# Altium project UCC 28180 PFC-V02.PrjPcb (part 1 of 2)
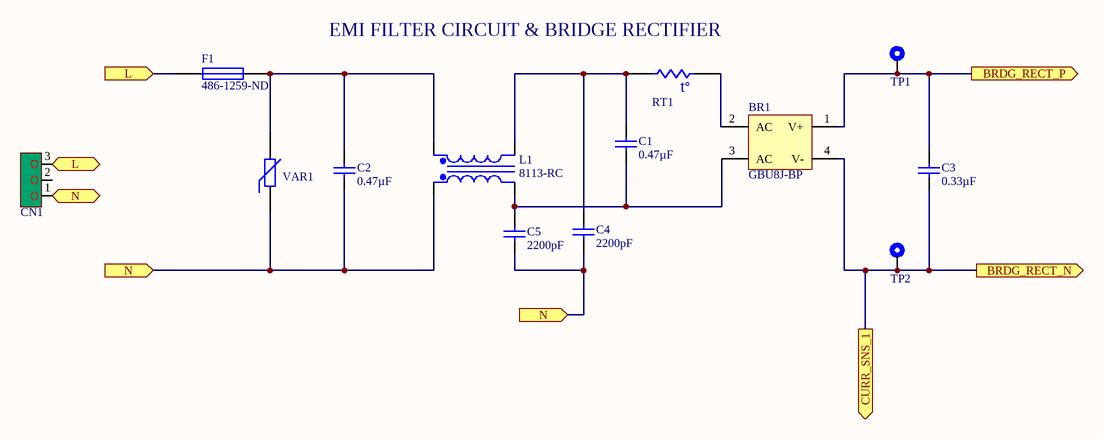
[diagram p0: UCC 28180-1-V02.SchDoc]
3 sheets, 78 parts. Net scope: flat (ports and power ports of the same name join across sheets).
Board file: UCC28180-V02.PcbDoc
Sheets:
  UCC 28180-1-V02.SchDoc
  UCC28180-2-V02.SchDoc
  UCC28180-3-V02.SchDoc

## Sheet UCC 28180-1-V02.SchDoc: Title is Here
size B; Author: Taisen Zhuang; Organization: Altium Limited; Address1: L3, 12a Rodborough Rd; Address2: Frenchs Forest; Address3: NSW; Address4: Australia 2086; DocumentNumber: FMC_Microzed; Revision: B; SheetNumber: 1; SheetTotal: 3

### Parts
BR1  GBU8J-BP  [GBU8J]
C1  Capacitance: 0.47µF  [ECQ-U2A474ML]  (hidden comment: ECQ-U2A474ML)
C2  Capacitance: 0.47µF  [ECQ-U2A474ML]  (hidden comment: ECQ-U2A474ML)
C3  Capacitance: 0.33µF  [CAPFILM0.33U]  (hidden comment: ECQ-U2A334ML)
C4  Capacitance: 2200pF  [CS11-E2GA222MYNS]  (hidden comment: CS11-E2GA222MYNS)
C5  Capacitance: 2200pF  [CS11-E2GA222MYNS]  (hidden comment: CS11-E2GA222MYNS)
CN1  1935789  [CONN_1935789]  (value not drawn)
F1  Supplier Part Number 1: 486-1259-ND  [0031.8211]  (hidden comment: FUSE)
L1  8113-RC  [EMI Choke]
RT1  CL-40  [CL-40]  (value not drawn)
TP1  5006  [Test Point]  (value not drawn)
TP2  5006  [Test Point]  (value not drawn)
VAR1  S10K275E2  [S10K275E2]  (value not drawn)

### Ports
BRDG_RECT_N (out), BRDG_RECT_P (out), CURR_SNS_1 (out), L (in), L (out), N (in), N (out)

### Nets
NetBR1_1: BR1.1(V+) C3.2 TP1.1 ; port BRDG_RECT_P
NetBR1_2: BR1.2(AC) RT1.1
NetBR1_3: BR1.3(AC) C1.1 C5.2 L1.2(Pri-)
NetBR1_4: BR1.4(V-) C3.1 TP2.1 ; port BRDG_RECT_N, port CURR_SNS_1
NetC1_2: C1.2 C4.2 L1.3(Sec-) RT1.2
NetC2_1: C2.1 F1.2 L1.4(Sec+) VAR1.2
NetC2_2: C2.2 C4.1 C5.1 CN1.1 L1.1(Pri+) VAR1.1 ; port N
NetCN1_3: CN1.3 F1.1 ; port L

Not connected (* = marked no-connect by the designer): CN1 2

### Notes on the sheet
- (near RT1) EMI FILTER CIRCUIT & BRIDGE RECTIFIER
- PMLS Engineers R&D
- Title:
- Size:
- Date:
- B
- Document Number:
- Sheet:
- of
- Author:
- Rev:
- (in symbol CL-40) t°

### Library data of the parts
BR1 = GBU8J-BP: RECT BRIDGE GPP 8A 600V GBU; Manufacturer 1: Micro Commercial Co; Category 1: Discrete Semiconductor Products; Diode Type: Single Phase; Supplier 1: Digi-Key; Supplier Part Number 1: GBU8J-BPMS-ND; RoHS 1: RoHS Compliant; Description 1: RECT BRIDGE GPP 8A 600V GBU; Stock 1: 5723; Pricing 1: 1=0.98, 10=0.868, 25=0.784, 100=0.686, 250=0.602, 500=0.532, 1000=0.42, 2500=0.392, 5000=0.3724 (USD); Packaging: Tube; Part Status: Active; Voltage - Peak Reverse (Max): 600V; Current - DC Forward (If) (Max): 8A; Mounting Type: Through Hole; Package / Case: 4-SIP, GBU; Operating Temperature: -55°C ~ 150°C (TJ); Supplier Device Package: GBU; ComponentLink1URL: http://www.mccsemi.com/up_pdf/GBU8A-GBU8M(GBU).pdf; ComponentLink1Description: http://www.mccsemi.com/up_pdf/GBU8A-GBU8M(GBU).pdf; Manufacturer Part Number 1: GBU8J-BP
C1 C2 = ECQ-U2A474ML: CAP FILM 0.47UF 20% 275VAC RAD; Manufacturer 1: Panasonic Electronic Components; Category 1: Capacitors; Voltage Rating - AC: 275V; Dielectric Material: Polyester, Metallized; Supplier 1: Digi-Key; Supplier Part Number 1: P10734-ND; Manufacturer Part Number 1: ECQ-U2A474ML; RoHS 1: RoHS Compliant; Description 1: CAP FILM 0.47UF 20% 275VAC RAD; Stock 1: 12592; Pricing 1: 1=0.63, 10=0.464, 25=0.3976, 50=0.371, 100=0.318, 250=0.29152, 500=0.25176, 1000=0.212, 5000=0.1855 (USD); Packaging: Bulk; Part Status: Active; Tolerance: ±20%; Voltage Rating - DC: -; ESR (Equivalent Series Resistance): -; Operating Temperature: -40°C ~ 100°C; Mounting Type: Through Hole; Package / Case: Radial; Size / Dimension: 1.004" L x 0.335" W (25.50mm x 8.50mm); Height - Seated (Max): 0.709" (18.00mm); Termination: PC Pins; Lead Spacing: 0.886" (22.50mm); Applications: EMI, RFI Suppression; Features: X2 Safety Rated; ComponentLink1URL: http://industrial.panasonic.com/www-cgi/jvcr13pz.cgi?E+PZ+3+ABD0029+ECQU2A474ML+7+WW; ComponentLink1Description: http://industrial.panasonic.com/www-cgi/jvcr13pz.cgi?E+PZ+3+ABD0029+ECQU2A474ML+7+WW
C3 = ECQ-U2A334ML: CAP FILM 0.33UF 20% 275VAC RAD; Manufacturer 1: Panasonic Electronic Components; Category 1: Capacitors; Voltage Rating - AC: 275V; Dielectric Material: Polyester, Metallized; Supplier 1: Digi-Key; Supplier Part Number 1: P10733-ND; Manufacturer Part Number 1: ECQ-U2A334ML; RoHS 1: RoHS Compliant; Description 1: CAP FILM 0.33UF 20% 275VAC RAD; Stock 1: 584; Pricing 1: 1=0.6, 10=0.428, 25=0.3652, 50=0.3234, 100=0.2816, 250=0.23988, 500=0.2086, 1000=0.17731, 5000=0.15645 (USD); Packaging: Bulk; Part Status: Active; Tolerance: ±20%; Voltage Rating - DC: -; ESR (Equivalent Series Resistance): -; Operating Temperature: -40°C ~ 100°C; Mounting Type: Through Hole; Package / Case: Radial; Size / Dimension: 0.689" L x 0.374" W (17.50mm x 9.50mm); Height - Seated (Max): 0.709" (18.00mm); Termination: PC Pins; Lead Spacing: 0.591" (15.00mm); Applications: EMI, RFI Suppression; Features: X2 Safety Rated; ComponentLink1URL: http://industrial.panasonic.com/www-cgi/jvcr13pz.cgi?E+PZ+3+ABD0029+ECQU2A334ML+7+WW; ComponentLink1Description: http://industrial.panasonic.com/www-cgi/jvcr13pz.cgi?E+PZ+3+ABD0029+ECQU2A334ML+7+WW
C4 C5 = CS11-E2GA222MYNS: CAP CER 2200PF 250VAC RADIAL; Manufacturer 1: TDK Corporation; Category 1: Capacitors; Tolerance: ±20%; Temperature Coefficient: E; Ratings: X1, Y2; Supplier 1: Digi-Key; Supplier Part Number 1: 445-2424-ND; Manufacturer Part Number 1: CS11-E2GA222MYNS; RoHS 1: RoHS Compliant; Description 1: CAP CER 2200PF 250VAC RADIAL; Stock 1: 67; Pricing 1: 1=0.5, 10=0.349, 100=0.2093, 250=0.17436, 500=0.15694, 1000=0.13253, 5000=0.11858, 10000=0.1116, 25000=0.10463 (USD); Packaging: Bulk; Part Status: Obsolete; Voltage - Rated: 250VAC; Operating Temperature: -25°C ~ 105°C; Features: High Voltage; Applications: Safety; Failure Rate: -; Mounting Type: Through Hole; Package / Case: Radial, Disc; Size / Dimension: 0.413" Dia (10.50mm); Height - Seated (Max): 0.571" (14.50mm); Thickness (Max): -; Lead Spacing: 0.295" (7.50mm); Lead Style: Straight; ComponentLink1URL: http://media.digikey.com/pdf/Data%20Sheets/TDK%20PDFs/CS_Series.pdf; ComponentLink1Description: http://media.digikey.com/pdf/Data%20Sheets/TDK%20PDFs/CS_Series.pdf
CN1 = 1935789: CONN TERM BLOCK 3POS 5.0MM; Manufacturer 1: Phoenix Contact; Category 1: Connectors, Interconnects; Number of Levels: 1; Positions Per Level: 3; Pitch: 0.197" (5.00mm); Mating Orientation: Horizontal with Board; Current: 20A; Voltage: 300V; Wire Gauge: 12-20 AWG; Wire Termination: Screw; Torque - Screw: 0.45-0.5 Nm (3.9-4.4 Lb-In); Screw Thread: M3; Supplier 1: Digi-Key; Supplier Part Number 1: 277-6072-ND; Manufacturer Part Number 1: 1935789; RoHS 1: RoHS Compliant; Description 1: CONN TERM BLOCK 3POS 5.0MM; Stock 1: 4677; Pricing 1: 1=0.66, 10=0.633, 50=0.605, 100=0.5885, 250=0.55, 500=0.506, 1000=0.4675 (USD); Packaging: Bulk; Part Status: Active; Mounting Type: Through Hole; Features: Interlocking (Side); Color: Green; Operating Temperature: -; Housing Material: Polyamide (PA), Nylon; Contact Material - Plating: -; Clamp Material - Plating: -; Screw Material - Plating: -; ComponentLink1URL: http://media.digikey.com/pdf/Data%20Sheets/Phoenix%20Contact%20PDFs/COMBICON%20Compact%20PT2,5.pdf; ComponentLink1Description: http://media.digikey.com/pdf/Data%20Sheets/Phoenix%20Contact%20PDFs/COMBICON%20Compact%20PT2,5.pdf
F1 = FUSE: Manufacturer: Schurter Inc.; Fuseholder Type: Block; Fuse Type: Cartridge; For Use With/Related Products: 5mm x 20mm; Number of Circuits: 1; Voltage: 500V; Current Rating: 10A; Supplier 1: Digi-Key; Manufacturer Part Number: 0031.8211; RoHS: RoHS Compliant; Category: Circuit Protection; Stock 1: 17476; Pricing 1: 1=0.69, 50=0.4932, 100=0.4658, 250=0.4384, 500=0.411, 1000=0.3836, 5000=0.36442 (USD); Part Status: Active; Fuse Size: 5mm x 20mm; Mounting Type: PCB; Orientation: Horizontal; Termination Style: PC Pin; Contact Material: Copper Alloy; Contact Finish: Tin; ComponentLink1URL: http://www.schurterinc.com/bundles/snceschurter/epim/_ProdPool_/newDS/en/typ_OGN.pdf; ComponentLink1Description: http://www.schurterinc.com/bundles/snceschurter/epim/_ProdPool_/newDS/en/typ_OGN.pdf
L1 = 8113-RC: CMC 5MH 8.9A 2LN TH; Manufacturer 1: Bourns Inc.; Category 1: Filters; Number of Lines: 2; Inductance @ Frequency: 5mH @ 1kHz; DC Resistance (DCR) (Max): 22 mOhm; Supplier 1: Digi-Key; Supplier Part Number 1: M8908-ND; RoHS 1: RoHS Compliant; Description 1: CMC 5MH 8.9A 2LN TH; Stock 1: 1449; Pricing 1: 1=7.52, 10=6.688, 25=6.1864, 50=5.5594 (USD); Packaging: Tray; Part Status: Active; Filter Type: -; Impedance @ Frequency: -; Current Rating (Max): 8.9A; Voltage Rating - DC: -; Voltage Rating - AC: -; Operating Temperature: -55°C ~ 105°C; Ratings: -; Approvals: -; Features: -; Mounting Type: Through Hole; Size / Dimension: 1.450" L x 0.800" W (36.83mm x 20.32mm); Height (Max): 1.500" (38.10mm); Package / Case: Vertical, 4 PC Pin; ComponentLink1URL: http://www.bourns.com/docs/Product-Datasheets/8100_series.pdf; ComponentLink1Description: http://www.bourns.com/docs/Product-Datasheets/8100_series.pdf; Manufacturer Part Number 1: 8113-RC
RT1 = CL-40: ICL 5 OHM 25% 6A 19.56MM; Manufacturer 1: Amphenol Advanced Sensors; Category 1: Circuit Protection; R @ 25°C: 5 Ohm; R @ Current: 0.11 Ohm; Approvals: UL; Supplier 1: Digi-Key; Supplier Part Number 1: KC004L-ND; Manufacturer Part Number 1: CL-40; RoHS 1: RoHS Compliant; Description 1: ICL 5 OHM 25% 6A 19.56MM; Stock 1: 7009; Pricing 1: 1=1.56, 5=1.512, 10=1.415, 25=1.3664, 50=1.1712, 100=0.976, 250=0.9516, 500=0.8052, 1000=0.7076 (USD); Packaging: Bulk; Part Status: Active; Tolerance: ±25%; Current - Steady State Max: 6A; Diameter: 0.77" (19.56mm); Lead Spacing: 0.328" (8.33mm); ComponentLink1URL: http://www.amphenol-sensors.com/index.php?option=com_edocman&task=document.download&id=90; ComponentLink1Description: http://www.amphenol-sensors.com/index.php?option=com_edocman&task=document.download&id=90
TP1 TP2 = 5006: TEST POINT PC COMPACT .063"D BLK; Manufacturer 1: Keystone Electronics; Category 1: Test and Measurement; Plating: Silver; Material - Insulation: Nylon 46, UL 94V-0; Material - Body: Phosphor Bronze; Supplier 1: Digi-Key; Supplier Part Number 1: 36-5006-ND; Manufacturer Part Number 1: 5006; RoHS 1: RoHS Compliant; Description 1: TEST POINT PC COMPACT .063"D BLK; Stock 1: 199444; Pricing 1: 1=0.37, 10=0.316, 50=0.2298, 100=0.2209, 250=0.19832, 500=0.18932, 1000=0.1616, 2500=0.14424, 5000=0.13523 (USD); Packaging: Bulk; Part Status: Active; Type: PC Test Point, Compact; Mounting Type: 0.063" (1.60mm) Hole Diameter; Color: Black; Size / Dimension: 0.125" Dia x 0.220" L (3.18mm x 5.59mm); ComponentLink1URL: http://www.keyelco.com/product-pdf.cfm?p=1314; ComponentLink1Description: http://www.keyelco.com/product-pdf.cfm?p=1314
VAR1 = S10K275E2: VARISTOR 430V 3.5KA DISC 10MM; Manufacturer 1: EPCOS (TDK); Category 1: Circuit Protection; Varistor Voltage (Min): 387V; Varistor Voltage (Max): 473V; Energy: 55J; Number of Circuits: 1; Maximum AC Volts: 275VAC; Maximum DC Volts: 350VDC; Supplier 1: Digi-Key; Supplier Part Number 1: 495-1433-ND; RoHS 1: RoHS Compliant; Description 1: VARISTOR 430V 3.5KA DISC 10MM; Stock 1: 24715; Pricing 1: 1=0.48, 10=0.4, 100=0.3003, 500=0.22022, 1000=0.17017, 5000=0.14515, 10000=0.13514 (USD); Packaging: Bulk; Part Status: Active; Varistor Voltage (Typ): 430V; Current - Surge: 3.5kA; Mounting Type: Through Hole; Package / Case: Disc 10mm; ComponentLink1URL: http://en.tdk.eu/inf/70/db/var_11/SIOV_Leaded_AdvanceD.pdf; ComponentLink1Description: http://en.tdk.eu/inf/70/db/var_11/SIOV_Leaded_AdvanceD.pdf; Manufacturer Part Number 1: S10K275E2

## Sheet UCC28180-2-V02.SchDoc: Title is Here
size B; Author: Taisen Zhuang; Organization: Altium Limited; Address1: L3, 12a Rodborough Rd; Address2: Frenchs Forest; Address3: NSW; Address4: Australia 2086; DocumentNumber: FMC_Microzed; Revision: B; SheetNumber: 1; SheetTotal: 3
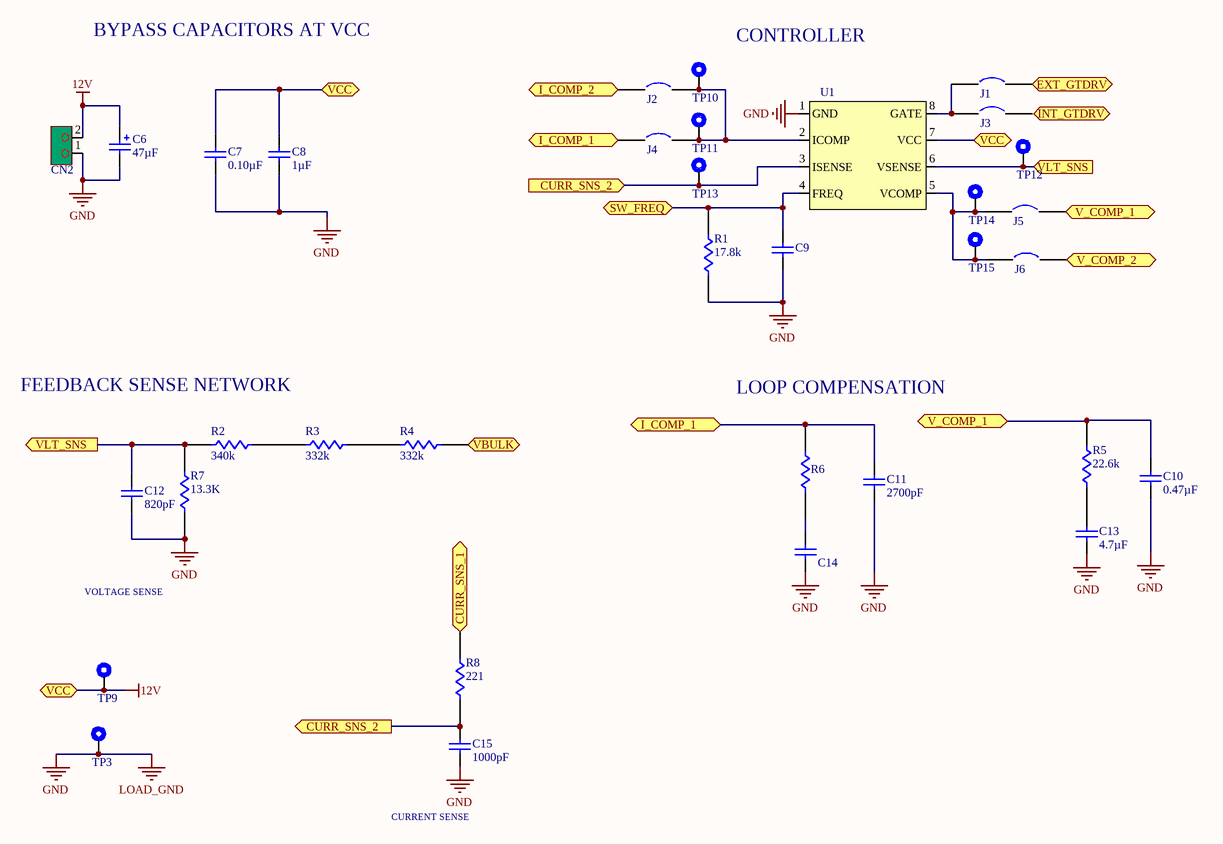
[diagram p1: UCC28180-2-V02.SchDoc]

### Parts
C6  Capacitance: 47µF  [CAPALUM47U]  (hidden comment: ECA-1VM470)
C7  Capacitance: 0.10µF  [CAP0603]  (hidden comment: 06035C104KAT2A)
C8  Capacitance: 1µF  [CAP1206]  (hidden comment: GRM32RR71H105KA01K)
C9  (no value)  [CAP0603]
C10  Capacitance: 0.47µF  [CAP0603]  (hidden comment: C0603C474K4RACTU)
C11  Capacitance: 2700pF  [CAP0603]  (hidden comment: GRM188R71H272KA01D)
C12  Capacitance: 820pF  [CAP0603]  (hidden comment: C0603C821K5RACTU)
C13  Capacitance: 4.7µF  [CAP0805]  (hidden comment: GRM21BR71A475KA73L)
C14  C0603--  [CAP0603]  (value not drawn)
C15  Capacitance: 1000pF  [CAP0603]  (hidden comment: 06031C102KAT2A)
CN2  1935776  [CONN_1935776]  (value not drawn)
J1  M20-9990246  [JUMPER]  (value not drawn)
J2  M20-9990246  [RES0603]  (value not drawn)
J3  M20-9990246  [JUMPER]  (value not drawn)
J4  M20-9990246  [RES0603]  (value not drawn)
J5  M20-9990246  [0603R]  (value not drawn)
J6  M20-9990246  [JUMPER]  (value not drawn)
R1  Resistance (Ohms): 17.8k  [RES0603]  (hidden comment: CRCW060317K8FKEA)
R2  Resistance (Ohms): 340k  [RES0805]  (hidden comment: CRCW0805340KFKEA)
R3  Resistance (Ohms): 332k  [RES0805]  (hidden comment: CRCW0805332KFKEA)
R4  Resistance (Ohms): 332k  [RES0805]  (hidden comment: CRCW0805332KFKEA)
R5  Resistance (Ohms): 22.6k  [CAP0603]  (hidden comment: CRCW060322K6FKEA)
R6  CRCW0603--  [RES0603]  (value not drawn)
R7  Resistance: 13.3K  [RES0603]  (hidden comment: CRCW060313K3FKEA)
R8  Resistance (Ohms): 221  [RES0805]  (hidden comment: CRCW0603221RFKEA)
TP3  5006  [Test Point]  (value not drawn)
TP9  5006  [Test Point]  (value not drawn)
TP10  5006  [Test Point]  (value not drawn)
TP11  5006  [Test Point]  (value not drawn)
TP12  5006  [Test Point]  (value not drawn)
TP13  5006  [Test Point]  (value not drawn)
TP14  5006  [Test Point]  (value not drawn)
TP15  5006  [Test Point]  (value not drawn)
U1  UCC28180DR  [SOP127P600X175-8N]  (value not drawn)

### Ports
CURR_SNS_1 (in), CURR_SNS_2 (in), CURR_SNS_2 (out), EXT_GTDRV (out), I_COMP_1 (bidir), I_COMP_2 (bidir), INT_GTDRV (out), SW_FREQ (bidir), V_COMP_1 (bidir), V_COMP_2 (bidir), VBULK (in), VCC (bidir), VLT_SNS (in), VLT_SNS (out)

### Nets
12V: C6.1 C7.1 C8.2 CN2.2 TP9.1 U1.7(VCC) ; port VCC
GND: C6.2 C7.2 C8.1 C9.1 C10.1 C11.1 C12.1 C13.1 C14.1 C15.1 CN2.1 R1.2 R7.2 TP3.1 U1.1(GND)  [also labelled LOAD_GND]
NetBR1_4: R8.1 ; port CURR_SNS_1
NetC9_2: C9.2 R1.1 U1.4(FREQ) ; port SW_FREQ
NetC10_2: C10.2 J5.2 R5.1 ; port V_COMP_1
NetC11_2: C11.2 J4.1 R6.1 ; port I_COMP_1
NetC12_2: C12.2 R2.2 R7.1 TP12.1 U1.6(VSENSE) ; port VLT_SNS
NetC13_2: C13.2 R5.2
NetC14_2: C14.2 R6.2
NetC15_2: C15.2 R8.2 TP13.1 U1.3(ISENSE) ; port CURR_SNS_2
NetJ1_1: J1.1 J3.1 U1.8(GATE)
NetJ1_2: J1.2 ; port EXT_GTDRV
NetJ2_1: J2.1 ; port I_COMP_2
NetJ2_2: J2.2 J4.2 TP10.1 TP11.1 U1.2(ICOMP)
NetJ5_1: J5.1 J6.1 TP14.1 TP15.1 U1.5(VCOMP)
NetJ6_2: J6.2 ; port V_COMP_2
NetR2_1: R2.1 R3.2
NetR3_1: R3.1 R4.2
NetR4_1: R4.1 ; port VBULK

Not connected (* = marked no-connect by the designer): J3 2

### Notes on the sheet
- BYPASS CAPACITORS AT VCC
- CONTROLLER
- FEEDBACK SENSE NETWORK
- LOOP COMPENSATION
- VOLTAGE SENSE
- CURRENT SENSE
- PMLS Engineers R&D
- Title:
- Size:
- Date:
- B
- Document Number:
- Sheet:
- of
- Author:
- Rev:

### Library data of the parts
C6 = ECA-1VM470: CAP ALUM 47UF 20% 35V RADIAL; Manufacturer 1: Panasonic Electronic Components; Category 1: Capacitors; Lifetime @ Temp.: 2000 Hrs @ 85°C; Polarization: Polar; Ripple Current: 130mA @ 120Hz; Supplier 1: Digi-Key; Supplier Part Number 1: P5164-ND; Manufacturer Part Number 1: ECA-1VM470; RoHS 1: RoHS Compliant; Description 1: CAP ALUM 47UF 20% 35V RADIAL; Stock 1: 32051; Pricing 1: 1=0.19, 10=0.131, 25=0.0964, 50=0.0788, 100=0.0665, 250=0.05424, 500=0.0455, 1000=0.04025, 5000=0.035 (USD); Packaging: Bulk; Part Status: Active; Tolerance: ±20%; Voltage Rating: 35V; ESR (Equivalent Series Resistance): -; Operating Temperature: -40°C ~ 85°C; Applications: General Purpose; Impedance: -; Lead Spacing: 0.079" (2.00mm); Size / Dimension: 0.197" Dia (5.00mm); Height - Seated (Max): 0.472" (12.00mm); Surface Mount Land Size: -; Mounting Type: Through Hole; Package / Case: Radial, Can; ComponentLink1URL: http://industrial.panasonic.com/www-cgi/jvcr13pz.cgi?E+PZ+3+ABA0012+ECA1VM470+7+WW; ComponentLink1Description: http://industrial.panasonic.com/www-cgi/jvcr13pz.cgi?E+PZ+3+ABA0012+ECA1VM470+7+WW
C7 = 06035C104KAT2A: CAP CER 0.1UF 50V X7R 0603; Manufacturer 1: AVX Corporation; Category 1: Capacitors; Tolerance: ±10%; Supplier 1: Digi-Key; Supplier Part Number 1: 478-5052-6-ND; Manufacturer Part Number 1: 06035C104KAT2A; RoHS 1: RoHS Compliant; Description 1: CAP CER 0.1UF 50V X7R 0603; Stock 1: 1164910; Pricing 1: 1=0.1, 10=0.037, 25=0.0268, 50=0.0202, 100=0.0165, 250=0.01376, 500=0.01176, 1000=0.00924 (USD); Packaging: Digi-Reel®; Part Status: Active; Voltage - Rated: 50V; Temperature Coefficient: X7R; Operating Temperature: -55°C ~ 125°C; Features: -; Ratings: -; Applications: General Purpose; Mounting Type: Surface Mount, MLCC; Package / Case: 0603 (1608 Metric); Size / Dimension: 0.063" L x 0.032" W (1.60mm x 0.81mm); Height - Seated (Max): -; Thickness (Max): 0.035" (0.90mm); Lead Spacing: -; Lead Style: -; ComponentLink1URL: http://datasheets.avx.com/X7RDielectric.pdf; ComponentLink1Description: http://datasheets.avx.com/X7RDielectric.pdf
C8 = GRM32RR71H105KA01K: CAP CER 1UF 50V X7R 1210; Manufacturer 1: Murata Electronics North America; Category 1: Capacitors; Tolerance: ±10%; Description 2: CAP CER 0.1UF 50V X7R 1206; Supplier 1: Digi-Key; Supplier Part Number 1: 490-11661-1-ND; Manufacturer Part Number 1: GRM32RR71H105KA01K; RoHS 1: RoHS Compliant; Description 1: CAP CER 1UF 50V X7R 1210; Stock 1: 3574; Pricing 1: 1=0.32, 10=0.28, 50=0.17, 100=0.14, 250=0.112, 500=0.102, 1000=0.092 (USD); Packaging: Cut Tape (CT); Part Status: Active; Voltage - Rated: 50V; Temperature Coefficient: X7R; Operating Temperature: -55°C ~ 125°C; Features: -; Ratings: -; Applications: General Purpose; Mounting Type: Surface Mount, MLCC; Package / Case: 1210 (3225 Metric); Size / Dimension: 0.126" L x 0.098" W (3.20mm x 2.50mm); Height - Seated (Max): -; Thickness (Max): 0.079" (2.00mm); Lead Spacing: -; Lead Style: -; ComponentLink1URL: http://www.murata.com/~/media/webrenewal/support/library/catalog/products/capacitor/mlcc/c02e.pdf; ComponentLink1Description: http://www.murata.com/~/media/webrenewal/support/library/catalog/products/capacitor/mlcc/c02e.pdf; Supplier 2: Digi-Key; Supplier Part Number 2: 478-1556-1-ND; Manufacturer 2: AVX Corporation; Manufacturer Part Number 2: 12065C104KAT2A; RoHS 2: RoHS Compliant; Category 2: Capacitors; Stock 2: 1310883; Pricing 2: 1=0.1, 10=0.073, 25=0.0528, 50=0.0412, 100=0.0341, 250=0.02824, 500=0.02392, 1000=0.0198 (USD); ComponentLink2URL: http://datasheets.avx.com/X7RDielectric.pdf; ComponentLink2Description: http://datasheets.avx.com/X7RDielectric.pdf
C9 = Cap: Capacitor; Published: 8-Jun-2000; LatestRevisionDate: 17-Jul-2002; Publisher: Altium Limited
C10 = C0603C474K4RACTU: CAP CER 0.47UF 16V X7R 0603; Manufacturer 1: KEMET; Category 1: Capacitors; Tolerance: ±10%; Supplier 1: Digi-Key; Supplier Part Number 1: 399-4922-1-ND; Manufacturer Part Number 1: C0603C474K4RACTU; RoHS 1: RoHS Compliant; Description 1: CAP CER 0.47UF 16V X7R 0603; Stock 1: 196985; Pricing 1: 1=0.15, 10=0.104, 25=0.0756, 50=0.0588, 100=0.0487, 250=0.04032, 500=0.03416, 1000=0.02828 (USD); Packaging: Cut Tape (CT); Part Status: Active; Voltage - Rated: 16V; Temperature Coefficient: X7R; Operating Temperature: -55°C ~ 125°C; Features: -; Ratings: -; Applications: General Purpose; Failure Rate: -; Mounting Type: Surface Mount, MLCC; Package / Case: 0603 (1608 Metric); Size / Dimension: 0.063" L x 0.031" W (1.60mm x 0.80mm); Height - Seated (Max): -; Thickness (Max): 0.034" (0.87mm); Lead Spacing: -; Lead Style: -; ComponentLink1URL: http://www.kemet.com/docfinder?Partnumber=C0603C474K4RACTU; ComponentLink1Description: http://www.kemet.com/docfinder?Partnumber=C0603C474K4RACTU
C11 = GRM188R71H272KA01D: CAP CER 2700PF 50V X7R 0603; Manufacturer 1: Murata Electronics North America; Category 1: Capacitors; Tolerance: ±10%; Supplier 1: Digi-Key; Supplier Part Number 1: 490-1502-6-ND; Manufacturer Part Number 1: GRM188R71H272KA01D; RoHS 1: RoHS Compliant; Description 1: CAP CER 2700PF 50V X7R 0603; Stock 1: 42465; Pricing 1: 1=0.1, 10=0.064, 25=0.0452, 50=0.0344, 100=0.0292, 250=0.02384, 500=0.0204, 1000=0.0159 (USD); Packaging: Digi-Reel®; Part Status: Active; Voltage - Rated: 50V; Temperature Coefficient: X7R; Operating Temperature: -55°C ~ 125°C; Features: -; Ratings: -; Applications: General Purpose; Mounting Type: Surface Mount, MLCC; Package / Case: 0603 (1608 Metric); Size / Dimension: 0.063" L x 0.031" W (1.60mm x 0.80mm); Height - Seated (Max): -; Thickness (Max): 0.035" (0.90mm); Lead Spacing: -; Lead Style: -; ComponentLink1URL: http://www.murata.com/~/media/webrenewal/support/library/catalog/products/capacitor/mlcc/c02e.pdf; ComponentLink1Description: http://www.murata.com/~/media/webrenewal/support/library/catalog/products/capacitor/mlcc/c02e.pdf
C12 = C0603C821K5RACTU: CAP CER 820PF 50V X7R 0603; Manufacturer 1: KEMET; Category 1: Capacitors; Tolerance: ±10%; Supplier 1: Digi-Key; Supplier Part Number 1: 399-1078-1-ND; Manufacturer Part Number 1: C0603C821K5RACTU; RoHS 1: RoHS Compliant; Description 1: CAP CER 820PF 50V X7R 0603; Stock 1: 19858; Pricing 1: 1=0.1, 10=0.052, 25=0.0376, 50=0.0282, 100=0.023, 250=0.01928, 500=0.01646, 1000=0.01293 (USD); Packaging: Cut Tape (CT); Part Status: Active; Voltage - Rated: 50V; Temperature Coefficient: X7R; Operating Temperature: -55°C ~ 125°C; Features: -; Ratings: -; Applications: General Purpose; Failure Rate: -; Mounting Type: Surface Mount, MLCC; Package / Case: 0603 (1608 Metric); Size / Dimension: 0.063" L x 0.031" W (1.60mm x 0.80mm); Height - Seated (Max): -; Thickness (Max): 0.034" (0.87mm); Lead Spacing: -; Lead Style: -; ComponentLink1URL: http://www.kemet.com/docfinder?Partnumber=C0603C821K5RACTU; ComponentLink1Description: http://www.kemet.com/docfinder?Partnumber=C0603C821K5RACTU
C13 = GRM21BR71A475KA73L: CAP CER 4.7UF 10V X7R 0805; Manufacturer 1: Murata Electronics North America; Category 1: Capacitors; Tolerance: ±10%; Supplier 1: Digi-Key; Supplier Part Number 1: 490-6480-1-ND; Manufacturer Part Number 1: GRM21BR71A475KA73L; RoHS 1: RoHS Compliant; Description 1: CAP CER 4.7UF 10V X7R 0805; Stock 1: 55696; Pricing 1: 1=0.27, 10=0.182, 50=0.11, 100=0.0924 (USD); Packaging: Cut Tape (CT); Part Status: Active; Voltage - Rated: 10V; Temperature Coefficient: X7R; Operating Temperature: -55°C ~ 125°C; Features: -; Ratings: -; Applications: General Purpose; Mounting Type: Surface Mount, MLCC; Package / Case: 0805 (2012 Metric); Size / Dimension: 0.079" L x 0.049" W (2.00mm x 1.25mm); Height - Seated (Max): -; Thickness (Max): 0.053" (1.35mm); Lead Spacing: -; Lead Style: -; ComponentLink1URL: http://www.murata.com/~/media/webrenewal/support/library/catalog/products/capacitor/mlcc/c02e.pdf; ComponentLink1Description: http://www.murata.com/~/media/webrenewal/support/library/catalog/products/capacitor/mlcc/c02e.pdf
C15 = 06031C102KAT2A: CAP CER 1000PF 100V X7R 0603; Manufacturer 1: AVX Corporation; Category 1: Capacitors; Tolerance: ±10%; Supplier 1: Digi-Key; Supplier Part Number 1: 478-1199-1-ND; Manufacturer Part Number 1: 06031C102KAT2A; RoHS 1: RoHS Compliant; Description 1: CAP CER 1000PF 100V X7R 0603; Stock 1: 182503; Pricing 1: 1=0.1, 10=0.037, 25=0.0268, 50=0.0202, 100=0.0165, 250=0.01376, 500=0.01176, 1000=0.00924 (USD); Packaging: Cut Tape (CT); Part Status: Active; Voltage - Rated: 100V; Temperature Coefficient: X7R; Operating Temperature: -55°C ~ 125°C; Features: -; Ratings: -; Applications: General Purpose; Mounting Type: Surface Mount, MLCC; Package / Case: 0603 (1608 Metric); Size / Dimension: 0.063" L x 0.032" W (1.60mm x 0.81mm); Height - Seated (Max): -; Thickness (Max): 0.035" (0.90mm); Lead Spacing: -; Lead Style: -; ComponentLink1URL: http://datasheets.avx.com/X7RDielectric.pdf; ComponentLink1Description: http://datasheets.avx.com/X7RDielectric.pdf
CN2 = 1935776: CONN TERM BLOCK 2POS 5.0MM; Manufacturer 1: Phoenix Contact; Category 1: Connectors, Interconnects; Number of Levels: 1; Positions Per Level: 2; Pitch: 0.197" (5.00mm); Mating Orientation: Horizontal with Board; Current: 20A; Voltage: 300V; Wire Gauge: 12-20 AWG; Wire Termination: Screw; Torque - Screw: 0.45-0.5 Nm (3.9-4.4 Lb-In); Screw Thread: M3; Supplier 1: Digi-Key; Supplier Part Number 1: 277-6405-ND; Manufacturer Part Number 1: 1935776; RoHS 1: RoHS Compliant; Description 1: CONN TERM BLOCK 2POS 5.0MM; Stock 1: 5591; Pricing 1: 1=0.43, 10=0.411, 50=0.3928, 100=0.382, 250=0.357, 500=0.32844, 1000=0.2975 (USD); Packaging: Bulk; Part Status: Active; Mounting Type: Through Hole; Features: Interlocking (Side); Color: Green; Operating Temperature: -; Housing Material: Polyamide (PA), Nylon; Contact Material - Plating: -; Clamp Material - Plating: -; Screw Material - Plating: -; ComponentLink1URL: http://media.digikey.com/pdf/Data%20Sheets/Phoenix%20Contact%20PDFs/COMBICON%20Compact%20PT2,5.pdf; ComponentLink1Description: http://media.digikey.com/pdf/Data%20Sheets/Phoenix%20Contact%20PDFs/COMBICON%20Compact%20PT2,5.pdf
J1-J6 = M20-9990246: SIL VERTICAL PC TAIL PIN HEADER; Manufacturer 1: Harwin Inc.; Category 1: Connectors, Interconnects; Connector Type: Header, Unshrouded, Breakaway; Number of Positions: 2; Number of Positions Loaded: All; Pitch: 0.100" (2.54mm); Supplier 1: Digi-Key; Supplier Part Number 1: 952-2262-ND; Manufacturer Part Number 1: M20-9990246; RoHS 1: RoHS Compliant; Description 1: SIL VERTICAL PC TAIL PIN HEADER; Stock 1: 66533; Pricing 1: 1=0.11, 10=0.099, 100=0.0609, 500=0.0504, 1000=0.0441, 5000=0.0378, 10000=0.03675 (USD); Packaging: Bulk; Part Status: Active; Contact Type: Male Pin; Number of Rows: 1; Row Spacing: -; Contact Mating Length: 0.240" (6.10mm); Mounting Type: Through Hole; Termination: Solder; Fastening Type: -; Features: -; Contact Finish: Tin; Contact Finish Thickness: -; Color: Black; ComponentLink1URL: https://cdn.harwin.com/pdfs/M20-999.pdf; ComponentLink1Description: https://cdn.harwin.com/pdfs/M20-999.pdf
R1 = CRCW060317K8FKEA: RES SMD 17.8K OHM 1% 1/10W 0603; Manufacturer 1: Vishay Dale; Category 1: Resistors; Power (Watts): 0.1W, 1/10W; Temperature Coefficient: ±100ppm/°C; Supplier 1: Digi-Key; Supplier Part Number 1: 541-17.8KHCT-ND; Manufacturer Part Number 1: CRCW060317K8FKEA; RoHS 1: RoHS Compliant; Description 1: RES SMD 17.8K OHM 1% 1/10W 0603; Stock 1: 18072; Pricing 1: 1=0.1, 10=0.03, 25=0.022, 50=0.0168, 100=0.0123, 250=0.0094, 500=0.00752, 1000=0.00554 (USD); Packaging: Cut Tape (CT); Part Status: Active; Tolerance: ±1%; Composition: Thick Film; Features: Automotive AEC-Q200; Operating Temperature: -55°C ~ 155°C; Package / Case: 0603 (1608 Metric); Supplier Device Package: 0603; Size / Dimension: 0.063" L x 0.033" W (1.60mm x 0.85mm); Height - Seated (Max): 0.020" (0.50mm); Number of Terminations: 2; Failure Rate: -; ComponentLink1URL: http://www.vishay.com/docs/20035/dcrcwe3.pdf; ComponentLink1Description: http://www.vishay.com/docs/20035/dcrcwe3.pdf
R2 = CRCW0805340KFKEA: RES SMD 340K OHM 1% 1/8W 0805; Manufacturer 1: Vishay Dale; Category 1: Resistors; Power (Watts): 0.125W, 1/8W; Temperature Coefficient: ±100ppm/°C; Supplier 1: Digi-Key; Supplier Part Number 1: 541-340KCCT-ND; Manufacturer Part Number 1: CRCW0805340KFKEA; RoHS 1: RoHS Compliant; Description 1: RES SMD 340K OHM 1% 1/8W 0805; Stock 1: 2950; Pricing 1: 1=0.1, 10=0.04, 25=0.0288, 50=0.022, 100=0.0162, 250=0.01236, 500=0.0099, 1000=0.00729 (USD); Packaging: Cut Tape (CT); Part Status: Active; Tolerance: ±1%; Composition: Thick Film; Features: Automotive AEC-Q200; Operating Temperature: -55°C ~ 155°C; Package / Case: 0805 (2012 Metric); Supplier Device Package: 0805; Size / Dimension: 0.079" L x 0.049" W (2.00mm x 1.25mm); Height - Seated (Max): 0.020" (0.50mm); Number of Terminations: 2; Failure Rate: -; ComponentLink1URL: http://www.vishay.com/docs/20035/dcrcwe3.pdf; ComponentLink1Description: http://www.vishay.com/docs/20035/dcrcwe3.pdf
R3 R4 = CRCW0805332KFKEA: RES SMD 332K OHM 1% 1/8W 0805; Manufacturer 1: Vishay Dale; Category 1: Resistors; Power (Watts): 0.125W, 1/8W; Temperature Coefficient: ±100ppm/°C; Supplier 1: Digi-Key; Supplier Part Number 1: 541-332KCCT-ND; Manufacturer Part Number 1: CRCW0805332KFKEA; RoHS 1: RoHS Compliant; Description 1: RES SMD 332K OHM 1% 1/8W 0805; Stock 1: 14758; Pricing 1: 1=0.1, 10=0.04, 25=0.0288, 50=0.022, 100=0.0162, 250=0.01236, 500=0.0099, 1000=0.00729 (USD); Packaging: Cut Tape (CT); Part Status: Active; Tolerance: ±1%; Composition: Thick Film; Features: Automotive AEC-Q200; Operating Temperature: -55°C ~ 155°C; Package / Case: 0805 (2012 Metric); Supplier Device Package: 0805; Size / Dimension: 0.079" L x 0.049" W (2.00mm x 1.25mm); Height - Seated (Max): 0.020" (0.50mm); Number of Terminations: 2; Failure Rate: -; ComponentLink1URL: http://www.vishay.com/docs/20035/dcrcwe3.pdf; ComponentLink1Description: http://www.vishay.com/docs/20035/dcrcwe3.pdf
R5 = CRCW060322K6FKEA: RES SMD 22.6K OHM 1% 1/10W 0603; Manufacturer 1: Vishay Dale; Category 1: Resistors; Power (Watts): 0.1W, 1/10W; Temperature Coefficient: ±100ppm/°C; Supplier 1: Digi-Key; Supplier Part Number 1: 541-22.6KHCT-ND; Manufacturer Part Number 1: CRCW060322K6FKEA; RoHS 1: RoHS Compliant; Description 1: RES SMD 22.6K OHM 1% 1/10W 0603; Stock 1: 27075; Pricing 1: 1=0.1, 10=0.03, 25=0.022, 50=0.0168, 100=0.0123, 250=0.0094, 500=0.00752, 1000=0.00554 (USD); Packaging: Cut Tape (CT); Part Status: Active; Tolerance: ±1%; Composition: Thick Film; Features: Automotive AEC-Q200; Operating Temperature: -55°C ~ 155°C; Package / Case: 0603 (1608 Metric); Supplier Device Package: 0603; Size / Dimension: 0.063" L x 0.033" W (1.60mm x 0.85mm); Height - Seated (Max): 0.020" (0.50mm); Number of Terminations: 2; Failure Rate: -; ComponentLink1URL: http://www.vishay.com/docs/20035/dcrcwe3.pdf; ComponentLink1Description: http://www.vishay.com/docs/20035/dcrcwe3.pdf
R7 = CRCW060313K3FKEA: RES SMD 13.3K OHM 1% 1/10W 0603; Manufacturer 1: Vishay Dale; Category 1: Resistors; Power (Watts): 0.1W, 1/10W; Temperature Coefficient: ±100ppm/°C; Supplier 1: Digi-Key; Supplier Part Number 1: 541-13.3KHCT-ND; Manufacturer Part Number 1: CRCW060313K3FKEA; RoHS 1: RoHS Compliant; Description 1: RES SMD 13.3K OHM 1% 1/10W 0603; Stock 1: 50587; Pricing 1: 1=0.1, 10=0.03, 25=0.022, 50=0.0168, 100=0.0123, 250=0.0094, 500=0.00752, 1000=0.00554 (USD); Packaging: Cut Tape (CT); Part Status: Active; Tolerance: ±1%; Composition: Thick Film; Features: Automotive AEC-Q200; Operating Temperature: -55°C ~ 155°C; Package / Case: 0603 (1608 Metric); Supplier Device Package: 0603; Size / Dimension: 0.063" L x 0.033" W (1.60mm x 0.85mm); Height - Seated (Max): 0.020" (0.50mm); Number of Terminations: 2; Failure Rate: -; ComponentLink1URL: http://www.vishay.com/docs/20035/dcrcwe3.pdf; ComponentLink1Description: http://www.vishay.com/docs/20035/dcrcwe3.pdf
R8 = CRCW0603221RFKEA: RES SMD 221 OHM 1% 1/10W 0603; Manufacturer 1: Vishay Dale; Category 1: Resistors; Power (Watts): 0.1W, 1/10W; Temperature Coefficient: ±100ppm/°C; Supplier 1: Digi-Key; Supplier Part Number 1: 541-221HCT-ND; Manufacturer Part Number 1: CRCW0603221RFKEA; RoHS 1: RoHS Compliant; Description 1: RES SMD 221 OHM 1% 1/10W 0603; Stock 1: 23466; Pricing 1: 1=0.1, 10=0.03, 25=0.022, 50=0.0168, 100=0.0123, 250=0.0094, 500=0.00752, 1000=0.00554 (USD); Packaging: Cut Tape (CT); Part Status: Active; Tolerance: ±1%; Composition: Thick Film; Features: Automotive AEC-Q200; Operating Temperature: -55°C ~ 155°C; Package / Case: 0603 (1608 Metric); Supplier Device Package: 0603; Size / Dimension: 0.063" L x 0.033" W (1.60mm x 0.85mm); Height - Seated (Max): 0.020" (0.50mm); Number of Terminations: 2; Failure Rate: -; ComponentLink1URL: http://www.vishay.com/docs/20035/dcrcwe3.pdf; ComponentLink1Description: http://www.vishay.com/docs/20035/dcrcwe3.pdf
TP3 TP9-TP15 = 5006: as TP1 on sheet UCC 28180-1-V02; Supplier 1: Digi-Key; Supplier Part Number 1: 36-5006-ND; Manufacturer Part Number 1: 5006; RoHS 1: RoHS Compliant; Description 1: TEST POINT PC COMPACT .063"D BLK; Stock 1: 199444; Pricing 1: 1=0.37, 10=0.316, 50=0.2298, 100=0.2209, 250=0.19832, 500=0.18932, 1000=0.1616, 2500=0.14424, 5000=0.13523 (USD); Packaging: Bulk; Part Status: Active; Type: PC Test Point, Compact; Mounting Type: 0.063" (1.60mm) Hole Diameter; Color: Black; Size / Dimension: 0.125" Dia x 0.220" L (3.18mm x 5.59mm); ComponentLink1URL: http://www.keyelco.com/product-pdf.cfm?p=1314; ComponentLink1Description: http://www.keyelco.com/product-pdf.cfm?p=1314
U1 = UCC28180DR: IC PFC CTRLR AVERAGE CURR 8SOIC; Manufacturer 1: Texas Instruments; Category 1: Integrated Circuits (ICs); Mode: Continuous Conduction (CCM); Frequency - Switching: 18kHz ~ 250kHz; Current - Startup: 75µA; Voltage - Supply: 21V; Supplier 1: Digi-Key; Supplier Part Number 1: 296-44502-2-ND; Manufacturer Part Number 1: UCC28180DR; RoHS 1: RoHS Compliant; Description 1: IC PFC CTRLR AVERAGE CURR 8SOIC; Stock 1: 5000; Pricing 1: 2500=0.50625 (USD); Packaging: Tape & Reel (TR); Part Status: Active; Operating Temperature: -40°C ~ 125°C; Mounting Type: Surface Mount; Package / Case: 8-SOIC (0.154", 3.90mm Width); Supplier Device Package: 8-SOIC; ComponentLink1URL: http://www.ti.com/lit/ds/symlink/ucc28180.pdf; ComponentLink1Description: http://www.ti.com/lit/ds/symlink/ucc28180.pdf

## Sheet UCC28180-3-V02.SchDoc: Title is Here
size B; Author: Taisen Zhuang; Organization: Altium Limited; Address1: L3, 12a Rodborough Rd; Address2: Frenchs Forest; Address3: NSW; Address4: Australia 2086; DocumentNumber: FMC_Microzed; Revision: B; SheetNumber: 1; SheetTotal: 3
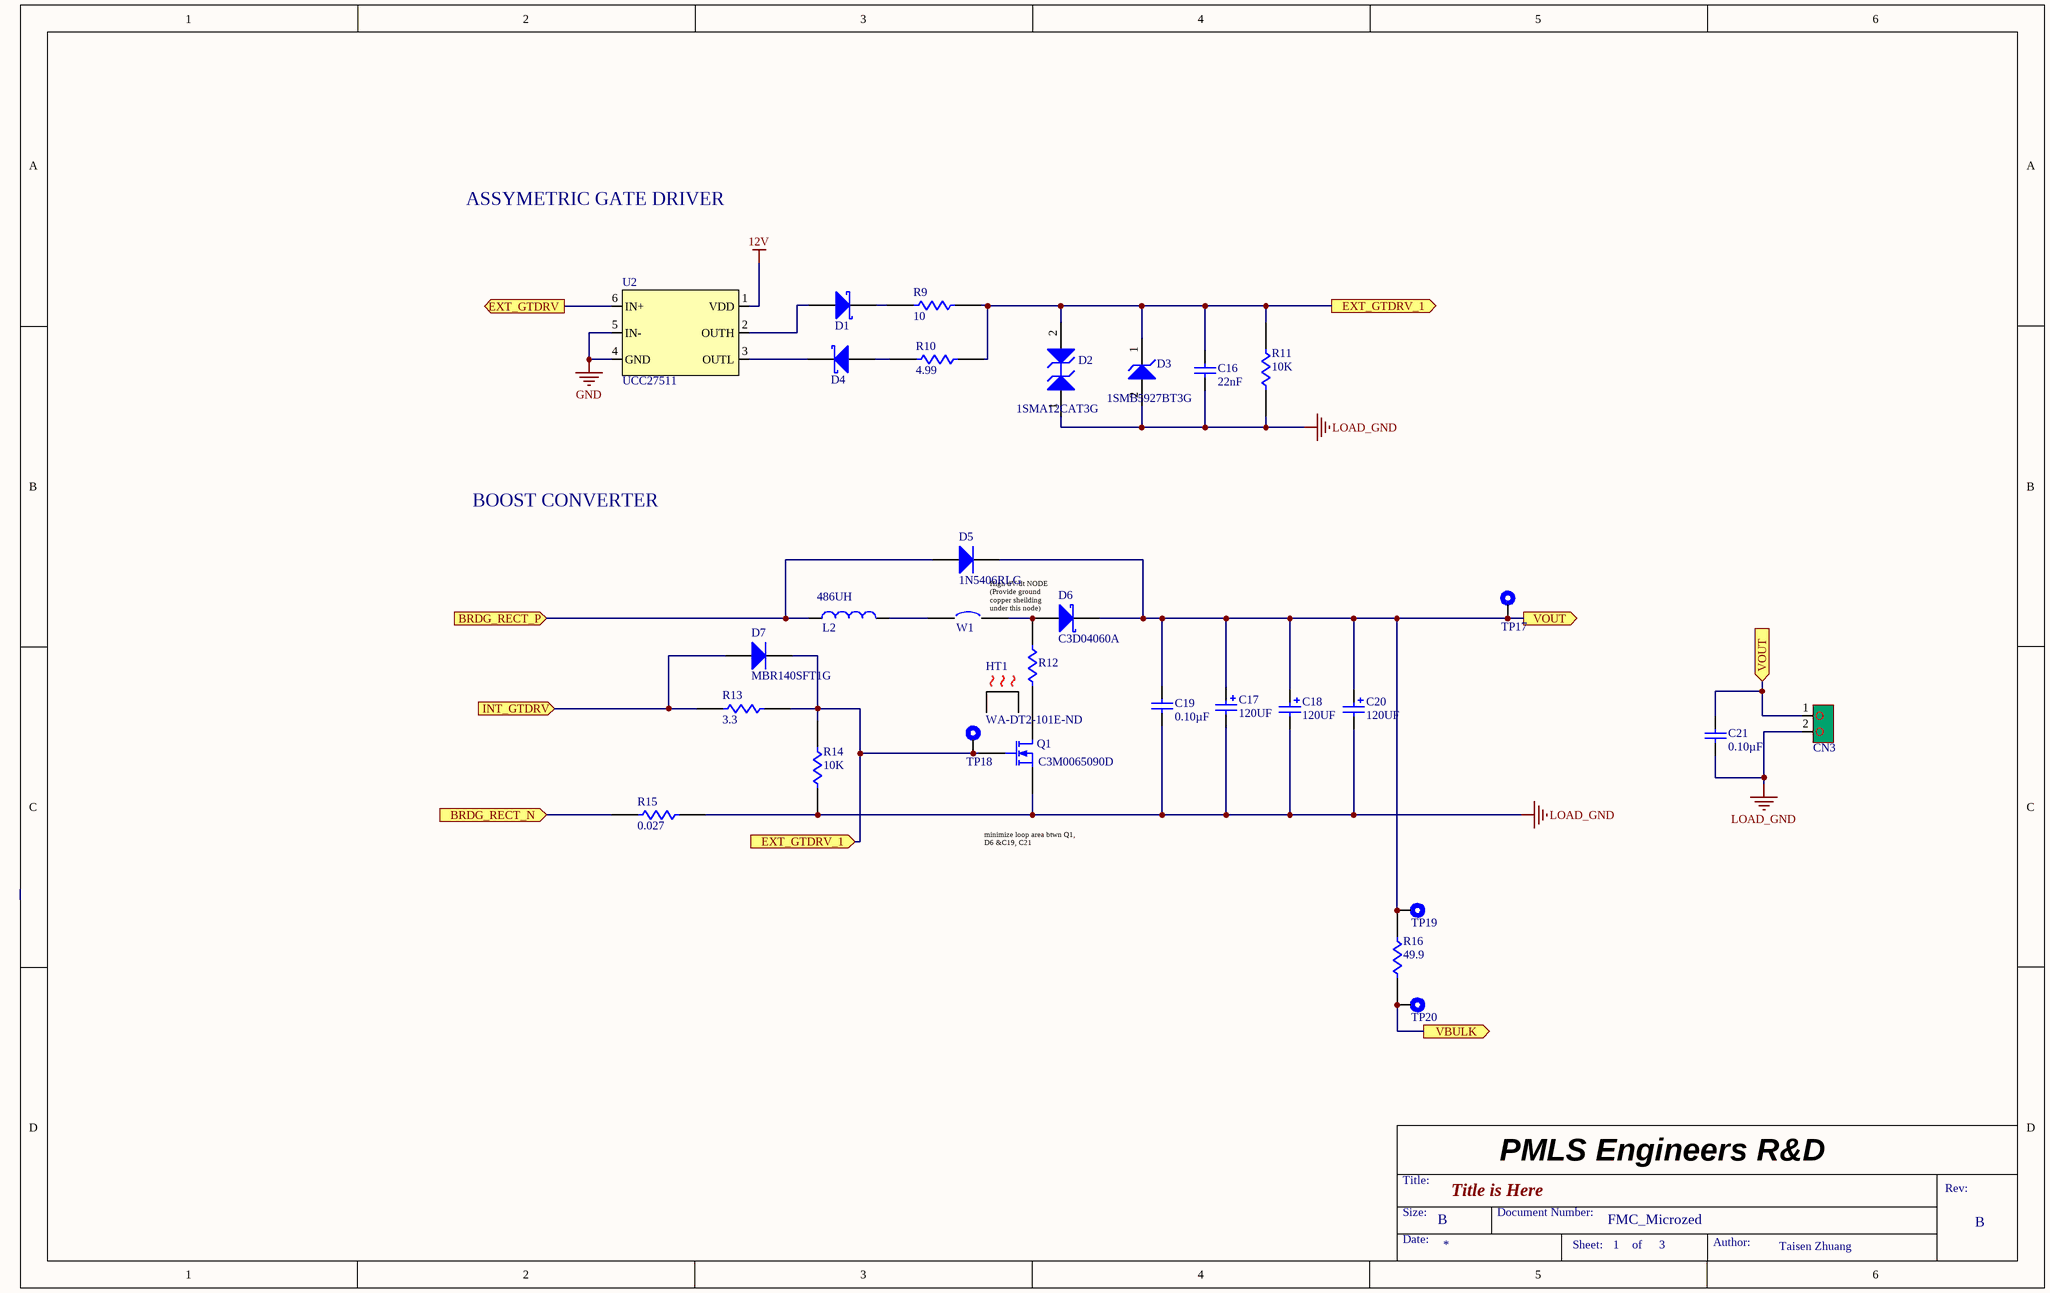
[diagram p2: UCC28180-3-V02.SchDoc]

### Parts
C16  Capacitance: 22nF  [CAP0603]  (hidden comment: C0603C22NF)
C17  Capacitance: 120UF  [450QXW120MEFC18X31.5]  (hidden comment: 450QXW120MEFC18X31.5)
C18  Capacitance: 120UF  [450QXW120MEFC18X31.5]  (hidden comment: 450QXW120MEFC18X31.5)
C19  Capacitance: 0.10µF  [CAP1812]  (hidden comment: GRM43DR72J104KW01L)
C20  Capacitance: 120UF  [450QXW120MEFC18X31.5]  (hidden comment: 450QXW120MEFC18X31.5)
C21  Capacitance: 0.10µF  [CAP1812]  (hidden comment: GRM43DR72J104KW01L)
CN3  1935776  [CONN_1935776]  (value not drawn)
D1  DB2W40300L  [Mini2-F3-B]  (value not drawn)
D2  1SMA12CAT3G  [ONSC-SMA-2-403D-02_F_V]
D3  1SMB5927BT3G  [ONSC-SMB-2-403A-03_H_V]
D4  DB2W40300L  [Mini2-F3-B]  (value not drawn)
D5  1N5406  [1N5406]  (value not drawn)
D6  C3D04060A  [C3D04060A]
D7  MBR140SFT1G  [SODFL360X95-2N]
HT1  WA-DT2-101E-ND  [WA-DT2-101E-ND]
L2  Inductance: 486UH  [XFUSMI4846-HO]  (hidden comment: XFUSMI4846-HO)
Q1  C3M0065090D  [TO-247-3]
R9  Resistance: 10  [RES0805]  (hidden comment: CRCW0805R10)
R10  Resistance: 4.99  [RES0805]  (hidden comment: CRCW0805R4.99)
R11  Resistance: 10K  [RES0603]  (hidden comment: CRCW0603RES10K)
R12  CRCWRSHUNT  [RES2512]  (value not drawn)
R13  Resistance (Ohms): 3.3  [RES1210]  (hidden comment: ERJ-P14J3R3U)
R14  Resistance: 10K  [RES0603]  (hidden comment: CRCW060310K0FKEA)
R15  Resistance: 0.027  [RES2512]  (hidden comment: CRCW2512R0.027)
R16  Resistance (Ohms): 49.9  [RES1206]  (hidden comment: CRCW120649R9FKEA)
TP17  5006  [Test Point]  (value not drawn)
TP18  5006  [Test Point]  (value not drawn)
TP19  5006  [Test Point]  (value not drawn)
TP20  5006  [Test Point]  (value not drawn)
U2  IC name: UCC27511  [SOP6]  (hidden comment: UCC27511DBV)
W1  Wire  [Current Sense Wire]  (value not drawn)

### Ports
BRDG_RECT_N (in), BRDG_RECT_P (in), EXT_GTDRV (out), EXT_GTDRV_1 (in), EXT_GTDRV_1 (out), INT_GTDRV (in), VBULK (out), VOUT (in), VOUT (out)

### Nets
12V: U2.1(VDD)
GND: C16.1 C17.2 C18.2 C19.1 C20.2 C21.1 CN3.2 D2.1(A1) D3.2(A) Q1.3(S) R11.2 R14.2 R15.1 U2.4(GND) U2.5(IN-)  [also labelled LOAD_GND]
NetBR1_1: D5.1(A) L2.1 ; port BRDG_RECT_P
NetBR1_4: R15.2 ; port BRDG_RECT_N
NetC16_2: C16.2 D2.2(A2) D3.1(K) D7.2 Q1.1(G) R9.1 R10.1 R11.1 R13.1 R14.1 TP18.1 ; port EXT_GTDRV_1
NetC17_1: C17.1 C18.1 C19.2 C20.1 C21.2 CN3.1 D5.2(K) D6.1(K) R16.1 TP17.1 TP19.1 ; port VOUT
NetD1_1: D1.1(K) R9.2
NetD1_3: D1.3(A) U2.2(OUTH)
NetD4_1: D4.1(K) U2.3(OUTL)
NetD4_3: D4.3(A) R10.2
NetD6_2: D6.2(A) R12.1 W1.2
NetD7_1: D7.1 R13.2 ; port INT_GTDRV
NetJ1_2: U2.6(IN+) ; port EXT_GTDRV
NetL2_2: L2.2 W1.1
NetQ1_2: Q1.2(D) R12.2
NetR4_1: R16.2 TP20.1 ; port VBULK

### Notes on the sheet
- ASSYMETRIC GATE DRIVER
- BOOST CONVERTER
- High dV/dt NODE (Provide ground copper sheilding under this node)
- minimize loop area btwn Q1, D6 &C19, C21
- PMLS Engineers R&D
- Title:
- Size:
- Date:
- B
- Document Number:
- Sheet:
- of
- Author:
- Rev:

### Library data of the parts
C19 C21 = GRM43DR72J104KW01L: CAP CER 0.1UF 630V X7R 1812; Manufacturer 1: Murata Electronics North America; Category 1: Capacitors; Tolerance: ±10%; Supplier 1: Digi-Key; Supplier Part Number 1: 490-3518-1-ND; Manufacturer Part Number 1: GRM43DR72J104KW01L; RoHS 1: RoHS Compliant; Description 1: CAP CER 0.1UF 630V X7R 1812; Stock 1: 99604; Pricing 1: 1=0.84, 10=0.803, 50=0.4796, 100=0.3897, 250=0.32372, 500=0.29376 (USD); Packaging: Cut Tape (CT); Part Status: Active; Voltage - Rated: 630V; Temperature Coefficient: X7R; Operating Temperature: -55°C ~ 125°C; Features: -; Ratings: -; Applications: General Purpose; Mounting Type: Surface Mount, MLCC; Package / Case: 1812 (4532 Metric); Size / Dimension: 0.177" L x 0.126" W (4.50mm x 3.20mm); Height - Seated (Max): -; Thickness (Max): 0.087" (2.20mm); Lead Spacing: -; Lead Style: -; ComponentLink1URL: http://www.murata.com/~/media/webrenewal/support/library/catalog/products/capacitor/mlcc/c02e.pdf; ComponentLink1Description: http://www.murata.com/~/media/webrenewal/support/library/catalog/products/capacitor/mlcc/c02e.pdf
CN3 = 1935776: as CN2 on sheet UCC28180-2-V02; Supplier 1: Digi-Key; Supplier Part Number 1: 277-6405-ND; Manufacturer Part Number 1: 1935776; RoHS 1: RoHS Compliant; Description 1: CONN TERM BLOCK 2POS 5.0MM; Stock 1: 5591; Pricing 1: 1=0.43, 10=0.411, 50=0.3928, 100=0.382, 250=0.357, 500=0.32844, 1000=0.2975 (USD); Packaging: Bulk; Part Status: Active; Mounting Type: Through Hole; Features: Interlocking (Side); Color: Green; Operating Temperature: -; Housing Material: Polyamide (PA), Nylon; Contact Material - Plating: -; Clamp Material - Plating: -; Screw Material - Plating: -; ComponentLink1URL: http://media.digikey.com/pdf/Data%20Sheets/Phoenix%20Contact%20PDFs/COMBICON%20Compact%20PT2,5.pdf; ComponentLink1Description: http://media.digikey.com/pdf/Data%20Sheets/Phoenix%20Contact%20PDFs/COMBICON%20Compact%20PT2,5.pdf
D1 D4 = DB2W40300L: Manufacturer: Panasonic; Diode: DB24403
D2 = 1SMA12CAT3G: 400 W Peak Power Zener Transient Voltage Suppressor, 2-Pin SMA, Pb-Free, Tape and Reel; Manufacturer: On Semiconductor; Direction: Bidirectional; IR Max (uA): 2.5; PPK Max (W): 400; V(BR) Typ (V): 14; DatasheetVersion: Rev. 12; PackageVersion: Rev. F, 11/2008; PackageReference: SMA-2-403D-02_F; PackageDescription: 2-Pin Small Molded Package, J-Bend Lead, Body 2.605 x 4.315 mm; Supplier 1: Digi-Key; Supplier Part Number 1: 1SMA12CAT3GOSTR-ND; Supplier 2: Digi-Key; Supplier Part Number 2: 1SMA12CAT3GOSCT-ND; Supplier 3: Digi-Key; Supplier Part Number 3: 1SMA12CAT3GOSDKR-ND; Supplier 4: Farnell; Supplier Part Number 4: 2369441; Supplier 5: Newark; Supplier Part Number 5: 10N9650; Supplier 6: Mouser; Supplier Part Number 6: 863-1SMA12CAT3G; Packing: Tape and Reel; RoHS: Pb-Free; Mounting Technology: Surface Mount; PartNumber: 1SMA12CAT3G; ComponentLink1Description: Manufacturer URL; ComponentLink1URL: http://www.onsemi.com/; ComponentLink2Description: Datasheet; ComponentLink2URL: http://www.onsemi.com/pub_link/Collateral/1SMA10CAT3-D.PDF; ComponentLink3Description: Package Specification; ComponentLink3URL: http://www.onsemi.com/pub_link/Collateral/1SMA5913BT3-D.PDF
D3 = 1SMB5927BT3G: 3 W Zener Voltage Regulator, 2-Pin SMB, Pb-Free, Tape and Reel; Manufacturer: On Semiconductor; VZ Typ (V): 12; DatasheetVersion: Rev. 8; PackageVersion: Rev. H, 05/2011; PackageReference: SMB-2-403A-03_H; PackageDescription: 2-Pin Small Molded Package, J-Bend Lead, Body 4.33 x 3.625 mm; Supplier 1: Digi-Key; Supplier Part Number 1: 1SMB5927BT3GOSTR-ND; Supplier 2: Digi-Key; Supplier Part Number 2: 1SMB5927BT3GOSCT-ND; Supplier 3: Farnell; Supplier Part Number 3: 1431169RL; Supplier 4: Farnell; Supplier Part Number 4: 1431169; Supplier 5: Farnell; Supplier Part Number 5: 2368211; Supplier 6: Newark; Supplier Part Number 6: 45J2452; Supplier 7: Newark; Supplier Part Number 7: 67R1409; Supplier 8: Mouser; Supplier Part Number 8: 863-1SMB5927BT3G; Packing: Tape and Reel; RoHS: Pb-Free; Mounting Technology: Surface Mount; PartNumber: 1SMB5927BT3G; ComponentLink1Description: Manufacturer URL; ComponentLink1URL: http://www.onsemi.com/; ComponentLink2Description: Datasheet; ComponentLink2URL: http://www.onsemi.com/pub_link/Collateral/1SMB5913BT3-D.PDF; ComponentLink3Description: Package Specification; ComponentLink3URL: http://www.onsemi.com/pub_link/Collateral/1SMB5913BT3-D.PDF
D5 = 1N5406RLG: DIODE GEN PURP 600V 3A DO201AD; Manufacturer: ON Semiconductor; Diode Type: Standard; Voltage - Forward (Vf) (Max) @ If: 1V @ 3A; Speed: Standard Recovery >500ns, > 200mA (Io); Current - Reverse Leakage @ Vr: 10µA @ 600V; Supplier 1: Digi-Key; RoHS: RoHS Compliant; Category: Discrete Semiconductor Products; Stock 1: 14400; Pricing 1: 1200=0.0966, 2400=0.08694, 6000=0.08211, 12000=0.07487, 30000=0.07004, 60000=0.06279 (USD); Packaging: Tape & Reel (TR); Part Status: Active; Capacitance @ Vr, F: -; Mounting Type: Through Hole; Package / Case: DO-201AA, DO-27, Axial; Supplier Device Package: DO-201AD; Operating Temperature - Junction: -65°C ~ 150°C; ComponentLink1URL: http://www.onsemi.com/pub_link/Collateral/1N5400-D.PDF; ComponentLink1Description: http://www.onsemi.com/pub_link/Collateral/1N5400-D.PDF; Supplier Part Number 1: 1N5406RLGOSTR-ND; Manufacturer Part Number: 1N5406RLG
D6 = C3D04060A: DIODE SCHOTTKY 600V 4A TO220-2; Manufacturer 1: Cree/Wolfspeed; Category 1: Discrete Semiconductor Products; Diode Type: Silicon Carbide Schottky; Current - Average Rectified (Io): 4A (DC); Voltage - Forward (Vf) (Max) @ If: 1.8V @ 4A; Speed: No Recovery Time > 500mA (Io); Reverse Recovery Time (trr): 0ns; Current - Reverse Leakage @ Vr: 50µA @ 600V; Capacitance @ Vr, F: 251pF @ 0V, 1MHz; Supplier 1: Digi-Key; Supplier Part Number 1: C3D04060A-ND; RoHS 1: RoHS Compliant; Description 1: DIODE SCHOTTKY 600V 4A TO220-2; Stock 1: 1157; Pricing 1: 1=1.94, 100=1.62, 500=1.39, 1000=1.2125 (USD); Packaging: Tube; Part Status: Active; Voltage - DC Reverse (Vr) (Max): 600V; Mounting Type: Through Hole; Package / Case: TO-220-2; Supplier Device Package: TO-220-2; Operating Temperature - Junction: -55°C ~ 175°C; ComponentLink1URL: http://www.wolfspeed.com/media/downloads/845/C3D04060A.pdf; ComponentLink1Description: http://www.wolfspeed.com/media/downloads/845/C3D04060A.pdf; Manufacturer Part Number 1: C3D04060A
D7 = MBR140SFT1G: DIODE SCHOTTKY 40V 1A SOD123L; Manufacturer: ON Semiconductor; Voltage - Forward (Vf) (Max) @ If: 550mV @ 1A; Speed: Fast Recovery =< 500ns, > 200mA (Io); Current - Reverse Leakage @ Vr: 500µA @ 40V; Supplier 1: Digi-Key; RoHS: RoHS Compliant; Category: Discrete Semiconductor Products; Stock 1: 0; Pricing 1: 3000=0.09129, 6000=0.08622, 15000=0.07861, 30000=0.07354, 75000=0.06593 (USD); Packaging: Tape & Reel (TR); Part Status: Active; Diode Type: Schottky; Voltage - DC Reverse (Vr) (Max): 40V; Current - Average Rectified (Io): 1A; Capacitance @ Vr, F: -; Mounting Type: Surface Mount; Package / Case: SOD-123F; Supplier Device Package: SOD-123L; Operating Temperature - Junction: -55°C ~ 125°C; ComponentLink1URL: http://www.onsemi.com/pub_link/Collateral/MBR140SFT1-D.PDF; ComponentLink1Description: http://www.onsemi.com/pub_link/Collateral/MBR140SFT1-D.PDF; Supplier Part Number 1: MBR140SFT1GOSTR-ND; Manufacturer Part Number: MBR140SFT1G
HT1 = WA-DT2-101E-ND: Manufacturer: Ohmite; Package Cooled: TO-220, TO-247 (Dual); Attachment Method: Clip and PC Pin; Shape: Rectangular, Fins; Power Dissipation @ Temperature Rise: 4W @ 40°C; Thermal Resistance @ Forced Air Flow: 6.0°C/W @ 200 LFM; Thermal Resistance @ Natural: 5°C/W; Material Finish: Black Anodized; Supplier 1: Digi-Key; Manufacturer Part Number: WA-DT2-101E; RoHS: RoHS Compliant; Category: Fans, Thermal Management; Stock 1: 173; Pricing 1: 1=4.43, 10=4.311, 25=4.194, 50=3.961, 100=3.728, 250=3.495, 500=3.3785, 1000=3.029 (USD); Part Status: Active; Type: Board Level, Vertical; Length: 1.200" (30.48mm); Width: 1.710" (43.43mm); Diameter: -; Height Off Base (Height of Fin): 0.630" (16.00mm); Material: Aluminum; ComponentLink1URL: http://media.digikey.com/pdf/Data%20Sheets/Ohmite%20PDFs/W_Series.pdf; ComponentLink1Description: http://media.digikey.com/pdf/Data%20Sheets/Ohmite%20PDFs/W_Series.pdf; Supplier Part Number 1: WA-DT2-101E-ND
Q1 = C3M0065090D: MOSFET N-CH 900V 36A TO247-3; Manufacturer 1: Cree/Wolfspeed; Category 1: Discrete Semiconductor Products; FET Type: N-Channel; Current - Continuous Drain (Id) @ 25°C: 36A (Tc); Drive Voltage (Max Rds On,  Min Rds On): 15V; Vgs(th) (Max) @ Id: 2.1V @ 5mA; Gate Charge (Qg) (Max) @ Vgs: 30.4nC @ 15V; Input Capacitance (Ciss) (Max) @ Vds: 660pF @ 600V; Vgs (Max): +18V, -8V; Power Dissipation (Max): 125W (Tc); Rds On (Max) @ Id, Vgs: 78 mOhm @ 20A, 15V; Supplier 1: Digi-Key; Supplier Part Number 1: C3M0065090D-ND; RoHS 1: RoHS Compliant; Description 1: MOSFET N-CH 900V 36A TO247-3; Stock 1: 4348; Pricing 1: 1=9.98, 100=9.62, 500=9.375 (USD); Packaging: Tube; Part Status: Active; Technology: SiCFET (Silicon Carbide); Drain to Source Voltage (Vdss): 900V; FET Feature: -; Operating Temperature: -55°C ~ 150°C (TJ); Mounting Type: Through Hole; Supplier Device Package: TO-247-3; Package / Case: TO-247-3; ComponentLink1URL: http://www.wolfspeed.com/media/downloads/176/C3M0065090D.pdf; ComponentLink1Description: http://www.wolfspeed.com/media/downloads/176/C3M0065090D.pdf; Manufacturer Part Number 1: C3M0065090D
R13 = ERJ-P14J3R3U: RES SMD 3.3 OHM 5% 1/2W 1210; Manufacturer 1: Panasonic Electronic Components; Category 1: Resistors; Power (Watts): 0.5W, 1/2W; Temperature Coefficient: -100/ +600ppm/°C; Supplier 1: Digi-Key; Supplier Part Number 1: P3.3ASCT-ND; Manufacturer Part Number 1: ERJ-P14J3R3U; RoHS 1: RoHS Compliant; Description 1: RES SMD 3.3 OHM 5% 1/2W 1210; Stock 1: 11138; Pricing 1: 1=0.27, 10=0.226, 25=0.1644, 50=0.1194, 100=0.0885, 250=0.06788, 500=0.05348, 1000=0.03703 (USD); Packaging: Cut Tape (CT); Part Status: Active; Tolerance: ±5%; Composition: Thick Film; Features: Automotive AEC-Q200, Pulse Withstanding; Operating Temperature: -55°C ~ 155°C; Package / Case: 1210 (3225 Metric); Supplier Device Package: 1210; Size / Dimension: 0.126" L x 0.098" W (3.20mm x 2.50mm); Height - Seated (Max): 0.028" (0.70mm); Number of Terminations: 2; Failure Rate: -; ComponentLink1URL: https://industrial.panasonic.com/cdbs/www-data/pdf/RDA0000/AOA0000C243.pdf; ComponentLink1Description: https://industrial.panasonic.com/cdbs/www-data/pdf/RDA0000/AOA0000C243.pdf
R14 = CRCW060310K0FKEA: RES SMD 10K OHM 1% 1/10W 0603; Manufacturer 1: Vishay Dale; Category 1: Resistors; Power (Watts): 0.1W, 1/10W; Temperature Coefficient: ±100ppm/°C; Supplier 1: Digi-Key; Supplier Part Number 1: 541-10.0KHCT-ND; Manufacturer Part Number 1: CRCW060310K0FKEA; RoHS 1: RoHS Compliant; Description 1: RES SMD 10K OHM 1% 1/10W 0603; Stock 1: 4972347; Pricing 1: 1=0.1, 10=0.03, 25=0.022, 50=0.0168, 100=0.0123, 250=0.0094, 500=0.00752, 1000=0.00554 (USD); Packaging: Cut Tape (CT); Part Status: Active; Tolerance: ±1%; Composition: Thick Film; Features: Automotive AEC-Q200; Operating Temperature: -55°C ~ 155°C; Package / Case: 0603 (1608 Metric); Supplier Device Package: 0603; Size / Dimension: 0.063" L x 0.033" W (1.60mm x 0.85mm); Height - Seated (Max): 0.020" (0.50mm); Number of Terminations: 2; Failure Rate: -; ComponentLink1URL: http://www.vishay.com/docs/20035/dcrcwe3.pdf; ComponentLink1Description: http://www.vishay.com/docs/20035/dcrcwe3.pdf
R16 = CRCW120649R9FKEA: RES SMD 49.9 OHM 1% 1/4W 1206; Manufacturer 1: Vishay Dale; Category 1: Resistors; Power (Watts): 0.25W, 1/4W; Temperature Coefficient: ±100ppm/°C; Supplier 1: Digi-Key; Supplier Part Number 1: 541-49.9FCT-ND; Manufacturer Part Number 1: CRCW120649R9FKEA; RoHS 1: RoHS Compliant; Description 1: RES SMD 49.9 OHM 1% 1/4W 1206; Stock 1: 25160; Pricing 1: 1=0.1, 10=0.054, 25=0.0392, 50=0.03, 100=0.0221, 250=0.01684, 500=0.01346, 1000=0.00991 (USD); Packaging: Cut Tape (CT); Part Status: Active; Tolerance: ±1%; Composition: Thick Film; Features: Automotive AEC-Q200; Operating Temperature: -55°C ~ 155°C; Package / Case: 1206 (3216 Metric); Supplier Device Package: 1206; Size / Dimension: 0.126" L x 0.063" W (3.20mm x 1.60mm); Height - Seated (Max): 0.024" (0.60mm); Number of Terminations: 2; Failure Rate: -; ComponentLink1URL: http://www.vishay.com/docs/20035/dcrcwe3.pdf; ComponentLink1Description: http://www.vishay.com/docs/20035/dcrcwe3.pdf
TP17-TP20 = 5006: as TP1 on sheet UCC 28180-1-V02; Supplier 1: Digi-Key; Supplier Part Number 1: 36-5006-ND; Manufacturer Part Number 1: 5006; RoHS 1: RoHS Compliant; Description 1: TEST POINT PC COMPACT .063"D BLK; Stock 1: 199444; Pricing 1: 1=0.37, 10=0.316, 50=0.2298, 100=0.2209, 250=0.19832, 500=0.18932, 1000=0.1616, 2500=0.14424, 5000=0.13523 (USD); Packaging: Bulk; Part Status: Active; Type: PC Test Point, Compact; Mounting Type: 0.063" (1.60mm) Hole Diameter; Color: Black; Size / Dimension: 0.125" Dia x 0.220" L (3.18mm x 5.59mm); ComponentLink1URL: http://www.keyelco.com/product-pdf.cfm?p=1314; ComponentLink1Description: http://www.keyelco.com/product-pdf.cfm?p=1314